# Altium schematic sheet CATS-EUROC-Overview.SchDoc: CATS EuRoC Edition
size A4; DocumentNumber: Overview; Revision: V1.0; SheetNumber: 1; SheetTotal: 16; Author: Luca Jost; Subtitle: Overview
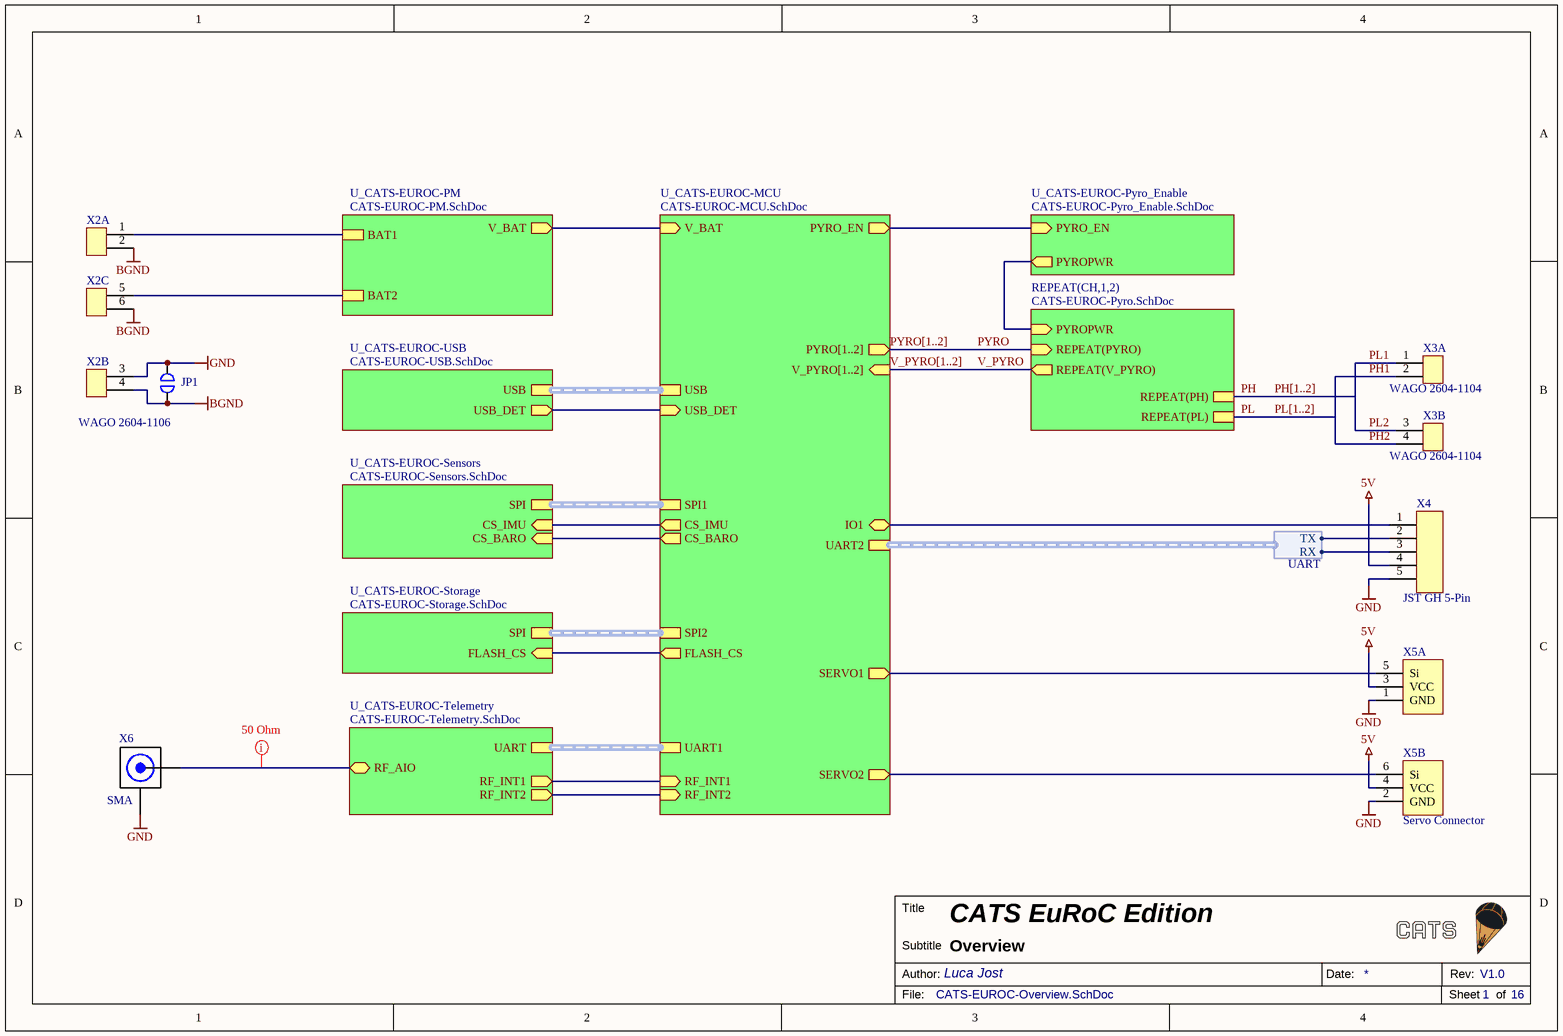
[diagram p0: CATS-EUROC-Overview.SchDoc]

## Parts
JP1  Jumper  [SMD Solder Jumper 1x2mm]  (value not drawn)  (no BOM)
X2  WAGO 2604-1106  [THT PCB Terminal Wago 2604-1106]  (value not drawn)  (parts A,B,C of 3)
X3  WAGO 2604-1104  [THT PCB Terminal Wago 2604-1104]  (parts A,B of 2)
X4  JST GH 5-Pin  [SMD Connector JST GH-5]
X5  Servo Connector  [THT Stiftleiste 6-Pol (2x3) 90°]  (value not drawn)  (parts A,B of 2)
X6  SMA  [THT Buchse SMA Female]

## Sub-sheets
REPEAT(CH,1,2) = CATS-EUROC-Pyro.SchDoc: REPEAT(V_PYRO) (out), REPEAT(PYRO) (in), REPEAT(PH), REPEAT(PL), PYROPWR (in)
U_CATS-EUROC-MCU = CATS-EUROC-MCU.SchDoc: SPI1 (harness SPI), UART1 (harness UART), USB (harness USB), V_PYRO[1..2] (in), PYRO[1..2] (out), IO1 (bidir), SERVO1 (out), SERVO2 (out), USB_DET (in), V_BAT (in), CS_IMU (out), CS_BARO (out), RF_INT1 (in), RF_INT2 (in), PYRO_EN (out), SPI2 (harness SPI), FLASH_CS (out), UART2 (harness UART)
U_CATS-EUROC-PM = CATS-EUROC-PM.SchDoc: V_BAT (out), BAT1, BAT2
U_CATS-EUROC-Pyro_Enable = CATS-EUROC-Pyro_Enable.SchDoc: PYRO_EN (in), PYROPWR (out)
U_CATS-EUROC-Sensors = CATS-EUROC-Sensors.SchDoc: CS_IMU (in), SPI, CS_BARO (in)
U_CATS-EUROC-Storage = CATS-EUROC-Storage.SchDoc: SPI (harness SPI), FLASH_CS (in)
U_CATS-EUROC-Telemetry = CATS-EUROC-Telemetry.SchDoc: UART, RF_INT1 (out), RF_INT2 (out), RF_AIO (bidir)
U_CATS-EUROC-USB = CATS-EUROC-USB.SchDoc: USB (harness USB), USB_DET (out)

## Harnesses
UART: TX, RX

## Nets
5V: X4.4 X5.3(VCC) X5.4(VCC)
BGND: JP1.2 X2.2 X2.4 X2.6
GND: JP1.1 X2.3 X4.5 X5.1(GND) X5.2(GND) X6.2(RF)
PH: sheet REPEAT(CH,1,2)/REPEAT(PH)
PH1: X3.2
PH2: X3.4
PL: sheet REPEAT(CH,1,2)/REPEAT(PL)
PL1: X3.1
PL2: X3.3
PYRO: sheet REPEAT(CH,1,2)/REPEAT(PYRO)
V_PYRO: sheet REPEAT(CH,1,2)/REPEAT(V_PYRO)
NetX2_1: X2.1 ; sheet U_CATS-EUROC-PM/BAT1
NetX2_5: X2.5 ; sheet U_CATS-EUROC-PM/BAT2
NetX4_1: X4.1 ; sheet U_CATS-EUROC-MCU/IO1
NetX4_2: X4.2 ; sheet U_CATS-EUROC-MCU/UART2.TX
NetX4_3: X4.3 ; sheet U_CATS-EUROC-MCU/UART2.RX
NetX5_5: X5.5(Si) ; sheet U_CATS-EUROC-MCU/SERVO1
NetX5_6: X5.6(Si) ; sheet U_CATS-EUROC-MCU/SERVO2
NetX6_1: X6.1(RF) ; sheet U_CATS-EUROC-Telemetry/RF_AIO
(unnamed): sheet U_CATS-EUROC-Sensors/CS_IMU, sheet U_CATS-EUROC-MCU/CS_IMU
(unnamed): sheet U_CATS-EUROC-Sensors/CS_BARO, sheet U_CATS-EUROC-MCU/CS_BARO
(unnamed): sheet U_CATS-EUROC-MCU/USB_DET, sheet U_CATS-EUROC-USB/USB_DET
(unnamed): sheet U_CATS-EUROC-MCU/V_BAT, sheet U_CATS-EUROC-PM/V_BAT
(unnamed): sheet U_CATS-EUROC-MCU/RF_INT1, sheet U_CATS-EUROC-Telemetry/RF_INT1
(unnamed): sheet U_CATS-EUROC-MCU/RF_INT2, sheet U_CATS-EUROC-Telemetry/RF_INT2
(unnamed): sheet U_CATS-EUROC-MCU/PYRO_EN, sheet U_CATS-EUROC-Pyro_Enable/PYRO_EN
(unnamed): sheet U_CATS-EUROC-MCU/FLASH_CS, sheet U_CATS-EUROC-Storage/FLASH_CS
(unnamed): sheet REPEAT(CH,1,2)/PYROPWR, sheet U_CATS-EUROC-Pyro_Enable/PYROPWR

## Buses and harness runs
bus PH[1..2]
bus PL[1..2]
bus PYRO[1..2] = sheet U_CATS-EUROC-MCU/PYRO[1..2]
bus V_PYRO[1..2] = sheet U_CATS-EUROC-MCU/V_PYRO[1..2]
harness sheet U_CATS-EUROC-MCU/SPI1 = sheet U_CATS-EUROC-Sensors/SPI
harness sheet U_CATS-EUROC-MCU/SPI2 = sheet U_CATS-EUROC-Storage/SPI
harness sheet U_CATS-EUROC-MCU/UART1 = sheet U_CATS-EUROC-Telemetry/UART
harness sheet U_CATS-EUROC-MCU/USB = sheet U_CATS-EUROC-USB/USB

## Layout directives
rule Impedance Constraint [Min = 50.00    Max = 50.00    ]; net class RF-Line 50: NetX6_1

## Notes on the sheet
- Title
- Author:
- Subtitle
- Date:
- Rev:
- File:
- Sheet
- of

## Library data of the parts
JP1 = Jumper-1: Single Position Jumper
X2 = WAGO 2604-1106: PCB terminal blocks with levers and Push-in CAGE CLAMP® connection; ComponentLink1Description: Datasheet; ComponentLink1URL: https://www.wago.com/us/pcb-interconnect/pcb-terminal-block/p/2604-1106
X3 = WAGO 2604-1104: PCB terminal blocks with levers and Push-in CAGE CLAMP® connection; ComponentLink1Description: Datasheet; ComponentLink1URL: https://www.wago.com/us/pcb-interconnect/pcb-terminal-block/p/2604-1106
X4 = JST GH 5-Pin: Connector Header Surface Mount, Right Angle 4 position 0.049" (1.25mm); ComponentLink1Description: Datasheet; ComponentLink1URL: https://www.jst-mfg.com/product/pdf/eng/eGH.pdf
X5 = Servo Connector Dual: 6 Pin header for PWM servos
X6 = SMA Connector: Female SMA Connector THT; Digikey: 931-1361-ND